# EasyEDA Pro project CW-LINK_PCB.epro

# Board CW-LINK
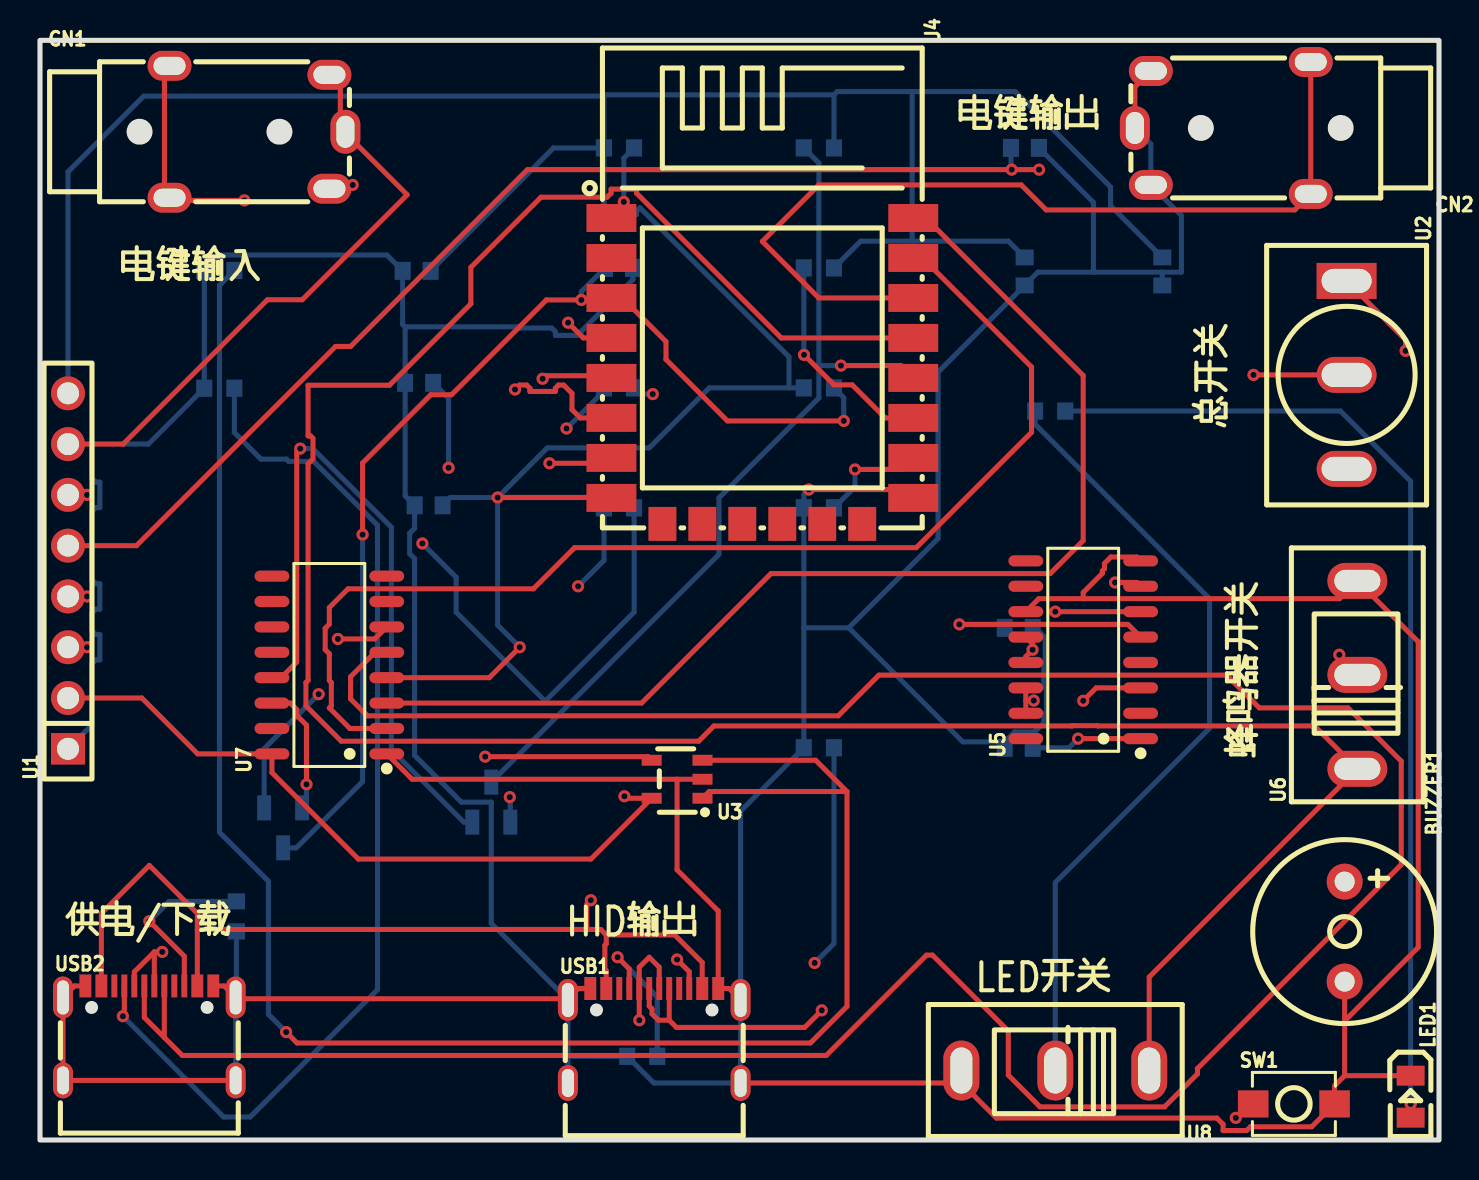
[diagram p0: board, top side]
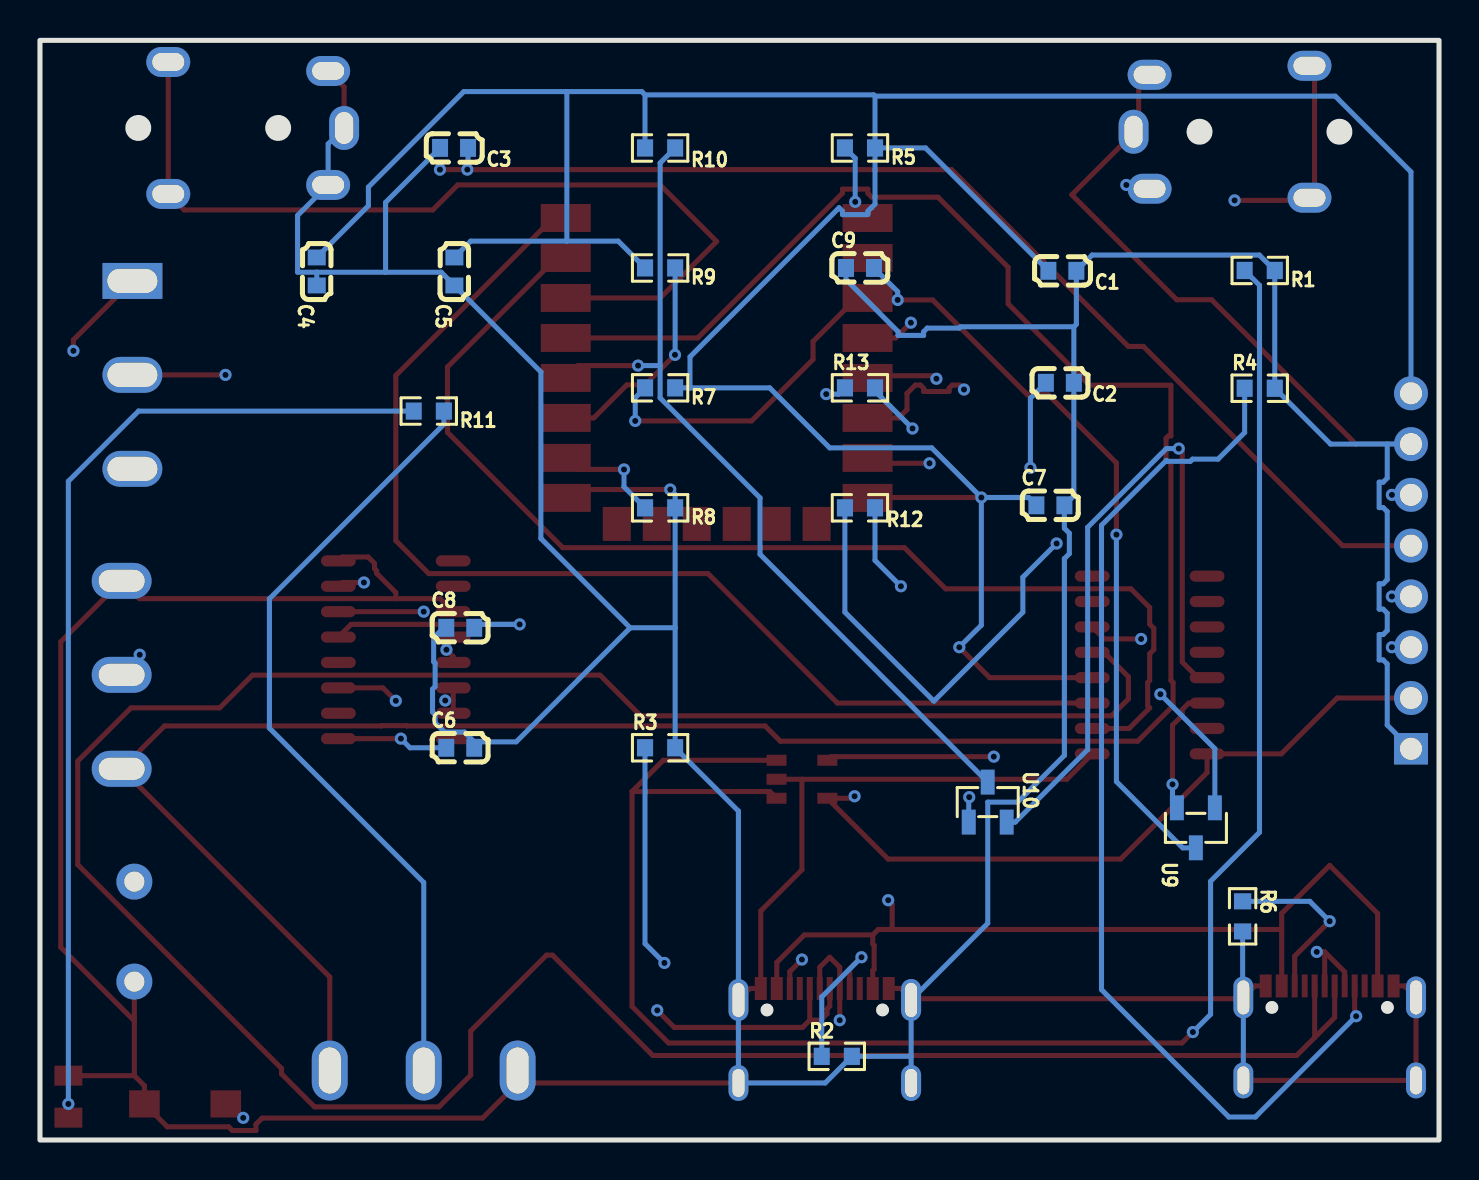
[diagram p1: board, bottom side, seen from below]

Outline 70 x 55 mm; copper layers: Top Layer, Inner1, Inner2, Bottom Layer. Coordinates in mm from the lower left corner of the outline.
Outline path: rectangle 0,55 70,0
Stack: Top Layer 0.035mm 外层铜厚1oz / Dielectric1 0.2104mm 7628 RC49% 8.6mil / Inner1 0.0152mm 内层铜厚 / Dielectric2 1.065mm 1.1mm H/HOZ 含铜 / Inner2 0.0152mm 内层铜厚 / Dielectric3 0.2104mm 7628 RC49% 8.6mil / Bottom Layer 0.035mm 外层铜厚1oz

## Design rules (mm)
template: 自定义配置
spacing copperThickness1oz (default): track to track 0.102, other pairs 0.152 to 0.3
spacing copperThickness2oz: track to track 0.203, other pairs 0.152 to 0.3
track width copperThickness1oz (default): min 0.127, default 0.254, max 2.54
track width normal: min 0.254, default 0.254, max 0.5
differential pair differentialPair (default): width min 0.127, default 0.254, max 2.54; gap min 0.152, default 0.152
via viaSize (default): diameter min 0.5, default 0.61, max 10; hole min 0.3, default 0.305, max 6.299
net TXD uses normal
net RXD uses normal
net KEY_OUT uses normal
net GPIO0 uses normal
net HID_TX uses normal
net KEY_IN2 uses normal
net LCD_SDA uses normal
net LCD_DC uses normal
net LCD_SCL uses normal
net KEY_IN1 uses normal
net EN uses normal
net RST uses normal
net $3N2016 uses normal
net $3N5513 uses normal
net $3N2666 uses normal
net D+ uses normal
net D- uses normal
net $3N2525 uses normal
net RTS uses normal
net DTR uses normal
net $3N3364 uses normal
net $3N3367 uses normal
net $3N4807 uses normal
net $3N4819 uses normal
net UD+ uses normal
net UD- uses normal
net $3N5016 uses normal
net $3N5218 uses normal
net $3N5212 uses normal
net $3N5338 uses normal
net $3N5795 uses normal
net $3N5844 uses normal

## Placement (name value [footprint] x y rotation side)
BUZZER1  3kHz  [BUZ-TH_BD9.0-P5.00-D0.6-FD]  65.28 10.42 270 top
C1  10uf  [C0603]  18.84 43.47 0 bottom
C2  470pf  [C0603]  18.97 37.87 0 bottom
C3  100nf  [C0603]  49.28 49.62 0 bottom
C4  10uf  [C0603]  56.15 43.44 90 bottom
C5  100nf  [C0603]  49.27 43.44 90 bottom
C6  200pf  [C0603]  48.97 19.62 180 bottom
C7  100nf  [C0603]  19.45 31.74 180 bottom
C8  10nf  [C0603]  48.97 25.62 180 bottom
C9  1uf  [C0603]  28.97 43.62 180 bottom
CN1  PJ-322A-Y  [AUDIO-TH_PJ-322A-Y]  10.88 50.43 0 top
CN2  PJ-322A-Y  [AUDIO-TH_PJ-322A-Y]  59.18 50.62 180 top
LED1  KT-0805W  [LED0805-R-RD]  68.58 2.17 270 top
R1  100K  [R0603]  8.97 43.49 0 bottom
R2  5.1K  [R0603]  30.13 4.19 180 bottom
R3  5.1K  [R0603]  38.97 19.62 180 bottom
R4  5.1K  [R0603]  8.97 37.6 180 bottom
R5  10K  [R0603]  28.97 49.62 0 bottom
R6  5.1K  [R0603]  9.83 11.18 270 bottom
R7  10K  [R0603]  38.97 37.62 0 bottom
R8  10K  [R0603]  38.97 31.62 0 bottom
R9  10K  [R0603]  38.97 43.62 0 bottom
R10  10K  [R0603]  38.97 49.62 0 bottom
R11  2R  [R0603]  50.55 36.46 0 bottom
R12  10K  [R0603]  28.97 31.62 0 bottom
R13  10K  [R0603]  28.97 37.62 180 bottom
SW1  -  [Key_SMD_3x4x2]  62.74 1.81 0 top
U1  PM254-1-08-Z-8.5  [HDR-TH_8P-P2.54-V-F]  1.4 28.46 90 top
U2  MT-0-102-A101-M200-RS  [SW-TH_MT-0-103-A101-M200-RS]  65.38 38.27 270 top
U3  MIC5219-3.3YM5-TR  [SOT-23-5_L3.0-W1.7-P0.95-LS2.8-TL]  31.88 18.04 180 top
U4  2.4GHz  [WIFIM-SMD_ESP-12F-ESP8266MOD]  36.14 38.46 270 top
U5  CH9328  [SOP-16_L10.0-W3.9-P1.27-LS6.0-BL]  52.2 24.52 90 top
U6  SS-12D10-G5  [SW-TH_SS-12D10-G050]  65.91 23.27 90 top
U7  CH340C  [SOP-16_L10.0-W3.9-P1.27-LS6.0-BL]  14.48 23.76 90 top
U8  SS-12D10-G5  [SW-TH_SS-12D10-G050]  50.8 3.48 180 top
U9  SS8050 Y1  [SOT-23-3_L2.9-W1.3-P1.90-LS2.4-BR]  12.17 15.61 90 bottom
U10  SS8050 Y1  [SOT-23-3_L2.9-W1.3-P1.90-LS2.4-BR]  22.58 16.9 270 bottom
USB1  TYPE-C16PIN  [USB-C-SMD_TYPE-C16PIN]  30.73 5.22 0 top
USB2  TYPE-C16PIN  [USB-C-SMD_TYPE-C16PIN]  5.47 5.34 0 top

## Footprints (pads in the part's own frame, mm; a bottom-side part is the same pattern mirrored in y, then rotated)
AUDIO-TH_PJ-322A-Y
  oval 1.5x2.2 hole 0.9x1.6: 1(4.4,0)
  oval 2.2x1.5 hole 1.6x0.9: 2(3.6,2.85) 3(-4.4,3.3) 3(-4.4,-3.3) 4(3.6,-2.85)
BUZ-TH_BD9.0-P5.00-D0.6-FD
  round 1.8 hole 1: 1(-2.5,0) 2(2.5,0)
C0603
  rect 0.8x0.9 smd: 1(-0.7,0) 2(0.7,0)
HDR-TH_8P-P2.54-V-F
  rect 1.575x1.7 hole 1.1: 1(-8.89,0)
  round 1.7 hole 1.1: 2(-6.35,0) 3(-3.81,0) 4(-1.27,0) 5(1.27,0) 6(3.81,0) 7(6.35,0) 8(8.89,0)
Key_SMD_3x4x2
  rect 1.53x1.36 smd: 1(-2.035,0) 2(2.035,0)
LED0805-R-RD
  rect 1x1.399 smd: 1(1.05,0) 2(-1.05,0)
R0603
  rect 0.806x0.864 smd: 1(-0.753,0) 2(0.753,0)
SOP-16_L10.0-W3.9-P1.27-LS6.0-BL
  oval 0.56x1.745 smd: 1(-4.445,-2.873) 2(-3.175,-2.873) 3(-1.905,-2.873) 4(-0.635,-2.873) 5(0.635,-2.873) 6(1.905,-2.873) 7(3.175,-2.873) 8(4.445,-2.873) 9(4.445,2.873) 10(3.175,2.873) 11(1.905,2.873) 12(0.635,2.873) 13(-0.635,2.873) 14(-1.905,2.873) 15(-3.175,2.873) 16(-4.445,2.873)
SOT-23-3_L2.9-W1.3-P1.90-LS2.4-BR
  rect 1.25x0.7 smd: 1(1,-0.95) 2(1,0.95) 3(-1,0)
SOT-23-5_L3.0-W1.7-P0.95-LS2.8-TL
  rect 1x0.55 smd: 1(-1.272,0.95) 2(-1.272,0) 3(-1.272,-0.95) 4(1.272,-0.95) 5(1.272,0.95)
SW-TH_MT-0-103-A101-M200-RS
  rect 1.8x3 hole 1.2x2.5: 1(-4.7,0)
  oval 1.8x3 hole 1.2x2.5: 2(0,0) 3(4.7,0)
SW-TH_SS-12D10-G050
  oval 1.8x3 hole 1.1x2.3: 1(-4.7,0) 2(0,0) 3(4.7,0)
USB-C-SMD_TYPE-C16PIN
  oval 1x2.1 hole 0.6x1.7: 1(-4.32,1.788) 2(4.32,1.788)
  oval 1x1.8 hole 0.6x1.4: 3(-4.32,-2.362) 4(4.32,-2.362)
  rect 0.6x1.15 smd: A1B12(-3.2,2.362) A4B9(-2.4,2.362) B1A12(3.2,2.362) B4A9(2.4,2.362)
  rect 0.3x1.15 smd: A5(-1.25,2.362) A6(-0.25,2.362) A7(0.25,2.362) A8(-1.75,2.362) B5(1.75,2.362) B6(0.75,2.362) B7(-0.75,2.362) B8(1.25,2.362)
WIFIM-SMD_ESP-12F-ESP8266MOD
  rect 1.4x2.5 smd: 1(-7.651,-7.551) 2(-5.651,-7.551) 3(-3.651,-7.551) 4(-1.651,-7.551) 5(0.349,-7.551) 6(2.349,-7.551) 7(4.349,-7.551) 8(6.349,-7.551) 9(6.349,7.548) 10(4.349,7.55) 11(2.349,7.551) 12(0.349,7.551) 13(-1.651,7.55) 14(-3.651,7.551) 15(-5.651,7.551) 16(-7.651,7.551)
  rect 1.7x1.4 smd: 17(7.651,-5) 18(7.649,-3.002) 19(7.649,-1.004) 20(7.649,0.998) 21(7.649,2.997) 22(7.651,4.997)

## Nets
3V3: C1.2 C4.2 C5.2 C7.1 R5.1 R7.1 R9.2 R10.2 U1.2 U1.8 U3.5 U4.8 U7.4 U7.16
5V_USB: U2.2 USB1.A4B9 USB1.B4A9 USB2.A4B9 USB2.B4A9
GND: BUZZER1.2 C1.1 C2.1 C3.2 C4.1 C5.1 C6.2 C7.2 C8.1 C9.1 CN1.1 CN1.2 CN2.1 CN2.2 CN2.4 LED1.2 R1.1 R2.2 R3.2 R4.2 R6.2 R8.1 SW1.2 U1.1 U1.7 U3.2 U4.9 U5.8 U5.11 U6.3 U7.1 U8.3 USB1.1 USB1.2 USB1.3 USB1.4 USB1.A1B12 USB1.B1A12 USB2.1 USB2.2 USB2.3 USB2.4 USB2.A1B12 USB2.B1A12
BEEP: U4.13 U6.1 U8.1
D+: U7.5 USB2.A6 USB2.B6
D-: U7.6 USB2.A7 USB2.B7
DTR: R12.2 U7.13 U10.2
EN: C9.2 R7.2 U4.3 U9.3
GPIO0: R10.1 U4.12 U10.3
HID_TX: R9.1 U4.11 U5.3
KEY_IN1: CN1.4 U4.4
KEY_IN2: CN1.3 R8.2 U4.10
KEY_OUT: CN2.3 U4.14
LCD_DC: U1.6 U4.6
LCD_SCL: U1.3 U4.5
LCD_SDA: U1.4 U4.7
RST: C3.1 R5.2 SW1.1 U1.5 U4.1
RTS: R13.2 U7.14 U9.2
RXD: U4.15 U7.2
TXD: U4.16 U7.3
UD+: U5.6 USB1.A6 USB1.B6
UD-: U5.7 USB1.A7 USB1.B7
$3N2016: C2.2 U3.4
$3N2525: R4.1 USB2.A5
$3N2666: R6.1 USB2.B5
$3N3364: R12.1 U9.1
$3N3367: R13.1 U10.1
$3N4807: C6.1 U5.1
$3N4819: C8.2 U5.5
$3N5016: U5.12 U5.13 U5.14 U5.15
$3N5212: R2.1 USB1.A5
$3N5218: R3.1 USB1.B5
$3N5338: BUZZER1.1 U6.2
$3N5513: R1.2 U2.1 U3.1 U3.3
$3N5795: R11.1 U8.2
$3N5844: LED1.1 R11.2

Pads without a net: U2 3; U4 2 17 18 19 20 21 22; U5 2 4 9 10 16; U7 7 8 9 10 11 12 15; USB1 A8 B8; USB2 A8 B8

## Via types
v1: diameter 0.61, hole 0.305, Top Layer to Bottom Layer, 55 vias

## Routing (per net, layer and track width the routed paths; a pad name or vN(x,y) marks a point on that pad's centre or on a via; arc(x,y) is an arc through that point)
3V3: length 209.9
  Top Layer w0.254: U7.4 22.48,23.12 v1(24,24.65) ; U1.2 5.1,22.11 7.89,19.31 U7.16 11.61,18.38 15.93,14.05 27.56,14.05 U3.5 29.34,17.09 v1(29.24,17.19) ; v1(22.9,32.14) 28.57,32.14 U4.8
  Inner1 w0.254: v1(24,24.65) 29.24,19.41 v1(29.24,17.19)
  Bottom Layer w0.254: C1.2 25.69,49.62 R5.1 ; v1(22.9,32.14) 20.54,32.14 C7.1 ; v1(22.9,32.14) 25.38,34.62 30.49,34.62 33.49,37.62 37.48,37.62 ; v1(22.9,32.14) 22.9,25.75 v1(24,24.65) ; 28.22,52.21 5.19,52.21 1.4,48.42 U1.8 ; 28.22,52.21 R5.1 ; 28.22,52.21 28.28,52.27 39.73,52.27 ; R5.1 28.22,46.81 28.4,46.63 28.4,46.63 28.58,46.46 28.58,46.29 29.85,46.29 29.85,46.46 30.02,46.63 37.48,39.17 37.48,37.62 ; 39.73,52.27 39.89,52.44 43.64,52.44 ; 39.73,52.27 R10.2 ; 37.48,37.62 R7.1 ; 43.64,52.44 48.79,52.44 53.57,47.66 53.57,46.73 C4.2 ; 43.64,52.44 43.64,44.96 ; R9.2 41.06,44.96 43.64,44.96 ; 43.64,44.96 48.45,44.96 C5.2
5V_USB: length 100.5
  Top Layer w0.254: 28.33,10.26 28.06,10.53 27.36,10.53 ; 28.33,10.26 28.33,9.81 28.26,9.74 28.26,8.54 28.33,8.47 USB1.A4B9 ; 28.33,10.26 31.76,10.26 33.13,8.88 USB1.B4A9 ; USB2.A4B9 3.07,11.33 5.47,13.73 7.87,11.33 7.87,10.53 ; 27.36,10.53 7.87,10.53 ; 27.36,10.53 27.36,11.79 v1(27.56,11.99) ; 7.87,10.53 USB2.B4A9 ; v1(60.72,38.27) U2.2
  Inner2 w0.254: v1(27.56,11.99) 45,11.99 60.72,27.71 v1(60.72,38.27)
GND: length 402.8
  Top Layer w0.254: 31.88,18.04 18.62,18.04 U7.1 ; 31.88,18.04 31.88,13.51 33.93,11.46 USB1.B1A12 34.48,7.58 USB1.2 ; 31.88,18.04 U3.2 ; 65.28,3.22 64.77,2.71 SW1.2 63.63,0.66 60.56,0.66 60.37,0.47 59.2,0.47 59.2,0.79 58.88,1.1 47.86,1.1 46.1,2.85 ; 65.28,3.22 65.28,5.96 ; 65.28,3.22 LED1.2 ; 46.1,2.85 U8.3 ; 46.1,2.85 USB1.4 ; 65.28,5.96 BUZZER1.2 ; 65.28,5.96 68.96,9.64 68.96,24.92 U6.3 65.02,27.08 52.2,27.08 ; USB2.4 USB2.3 USB2.1 1.73,7.71 USB2.A1B12 ; USB1.A1B12 26.92,7.58 26.41,7.07 ; 26.41,7.07 USB1.1 ; 26.41,7.07 9.85,7.07 USB2.2 9.22,7.71 USB2.B1A12 ; 52.2,27.08 49.97,27.08 U5.11 ; 52.2,27.08 52.2,27.38 53.16,28.34 53.16,28.47 53.26,28.57 53.26,28.84 53.58,29.16 54.88,29.16 U5.8 ; CN2.1 54.78,52.67 CN2.4 ; U4.9 43.27,32.53 v1(38.47,32.53) ; U1.7 4.16,34.81 11.38,42.03 13.12,42.03 18.37,47.27 15.03,50.62 15.03,52.67 14.23,53.47
  Bottom Layer w0.254: 40.47,25.62 38.22,25.62 ; 40.47,25.62 46.17,19.91 48.27,19.91 ; 40.47,25.62 44.94,30.09 44.94,38.41 C5.1 49.93,43.4 52.71,43.4 ; 38.22,25.62 R8.1 38.22,32.29 v1(38.47,32.53) ; 38.22,25.62 R3.2 35.05,16.45 USB1.2 USB1.4 30.71,2.85 R2.2 26.41,4.19 ; 2.59,34.81 5.42,34.81 R4.2 R1.1 8.99,44.26 17.36,44.26 C1.1 18.14,40.8 18.27,40.67 ; 2.59,34.81 2.59,33.1 2.79,32.9 2.99,32.9 2.99,31.63 2.79,31.63 2.59,31.43 2.59,28.02 2.79,27.82 2.99,27.82 2.99,26.55 2.79,26.55 2.59,26.35 2.59,25.48 2.79,25.28 2.99,25.28 2.99,24.01 2.79,24.01 2.59,23.81 2.59,20.76 U1.1 ; 2.59,34.81 U1.7 ; 26.41,4.19 USB1.1 22.58,10.84 22.58,16.9 21.08,16.9 18.74,19.24 18.74,29.08 18.5,29.32 18.5,30.35 18.74,30.6 18.74,31.74 18.27,32.22 C2.1 18.27,40.67 ; 26.41,4.19 USB1.3 ; 52.71,43.4 52.71,46.89 C3.2 ; 52.71,43.4 56.15,43.4 ; C6.2 48.27,19.91 ; 48.27,19.91 48.77,20.41 49.76,20.41 50.23,20.88 50.23,21.28 50.36,21.41 50.36,22.55 50.23,22.68 50.23,23.85 50.3,23.92 50.3,25.12 49.8,25.62 C8.1 ; 18.27,40.67 23.94,40.67 24,40.61 25.61,40.61 25.79,40.43 25.79,40.24 27.06,40.24 27.06,40.43 29.67,43.04 C9.1 ; 56.15,43.4 C4.1 ; 56.15,43.4 57.11,43.4 57.11,46.24 CN2.2 55.58,49.82 CN2.1 ; USB2.4 USB2.2 9.83,7.16 R6.2
BEEP: length 129
  Top Layer w0.254: U8.1 55.5,8.15 U6.1 63.77,20.71 52.92,20.71 52.91,20.72 51.65,20.72 51.64,20.71 33.72,20.71 32.96,19.95 15.07,19.95 13.31,21.72 13.31,22.88 13.41,22.99 13.41,33.82 13.66,34.07 13.66,35.09 13.54,35.22 13.41,35.22 13.41,37.75 17.49,37.75 21.56,41.82 21.56,43.65 25.07,47.16 28.37,47.16 28.58,47.36 28.58,47.56 29.85,47.56 29.85,47.36 37.09,40.12 U4.13
D+: length 143.7
  Top Layer w0.254: 6.22,5.13 5.22,6.13 USB2.A6 ; 6.22,5.13 USB2.B6 ; 6.22,5.13 7.12,4.23 39.34,4.23 44.35,9.25 44.66,9.25 48.45,5.45 48.45,3.24 50.04,1.66 56.26,1.66 57.91,3.31 57.91,3.58 68.11,13.77 68.11,18.95 65.45,21.61 61.01,21.61 59.37,23.25 41.97,23.25 39.94,21.22 16.38,21.22 15.54,22.06 15.54,23.17 16.76,24.39 U7.5
D-: length 28.5
  Top Layer w0.254: U7.6 16.75,25.06 v1(14.91,25.06) ; 5.72,9.41 4.72,8.41 USB2.B7 ; 5.72,9.41 USB2.A7 ; 5.72,9.41 v1(6.12,9.41)
  Inner1 w0.254: v1(6.12,9.41) 6.12,20.12 9.61,23.61 12.37,23.61 13.82,25.06 v1(14.91,25.06)
DTR: length 65.2
  Top Layer w0.254: U7.13 12.06,23.12 12.85,23.9 12.85,34.4 v1(13.02,34.58)
  Inner2 w0.254: v1(19.13,29.84) 14.39,34.58 v1(13.02,34.58)
  Bottom Layer w0.254: v1(13.02,34.58) 13.65,34.58 17.58,30.65 17.58,19.52 21.2,15.9 U10.2 ; R12.2 29.73,26.4 25.27,21.95 20.82,26.4 20.82,28.15 v1(19.13,29.84)
EN: length 55.8
  Top Layer w0.254: v1(40.22,35.97) 34.4,35.97 31.32,39.04 31.32,39.93 29.14,42.12 U4.3 28.49,42.02 v1(27.09,42.02) 25.34,42.02 20.59,37.27 19.55,37.27 16.14,33.86 v1(16.14,30.28)
  Bottom Layer w0.254: R7.2 40.22,37.13 v1(40.22,35.97) ; U9.3 12.83,14.61 16.14,17.93 v1(16.14,30.28) ; C9.2 27.09,42.43 v1(27.09,42.02)
GPIO0: length 43.8
  Top Layer w0.254: U4.12 43.08,38.73 v1(40.07,38.73)
  Bottom Layer w0.254: R10.1 38.97,48.86 38.97,38.73 ; U10.3 33.97,29.29 33.97,32.12 38.97,37.12 38.97,38.73 ; v1(40.07,38.73) 38.97,38.73
HID_TX: length 37.9
  Top Layer w0.254: v1(52.2,21.97) 52.84,22.61 U5.3 ; U4.11 42.29,36.12 40.64,37.77 39.73,37.77 v1(38.23,39.27)
  Inner1 w0.254: v1(38.23,39.27) 39.51,37.99 40.39,37.99 52.2,26.18 v1(52.2,21.97)
  Bottom Layer w0.254: R9.1 38.22,39.28 v1(38.23,39.27)
KEY_IN1: length 17.5
  Top Layer w0.254: U4.4 27.19,40.12 v1(26.42,40.88) ; v1(15.65,47.77) 14.23,47.77
  Inner1 w0.254: v1(26.42,40.88) 22.54,40.88 v1(15.65,47.77)
KEY_IN2: length 54.7
  Top Layer w0.254: 6.23,53.92 6.23,47.32 6.55,47 v1(10.23,47) ; U4.10 43.12,33.54 v1(40.78,33.54)
  Inner2 w0.254: v1(40.78,33.54) 34.3,33.54 31.85,35.99 27.1,35.99 26.86,36.22 25.82,36.22 25.59,35.99 25.38,36.2 25.38,37.24 25.58,37.44 25.78,37.44 25.78,38.71 25.58,38.71 22.64,41.66 15.57,41.66 v1(10.23,47)
  Bottom Layer w0.254: v1(40.78,33.54) 40.78,32.67 R8.2
KEY_OUT: length 44.8
  Top Layer w0.254: U4.14 38.97,42.12 36.14,44.94 38.97,47.77 49.1,47.77 50.35,46.52 62.78,46.52 CN2.3 CN2.3
LCD_DC: length 32.5
  Top Layer w0.254: v1(23.77,37.54) 23.99,37.76 24.35,37.76 24.51,37.6 24.51,37.44 25.78,37.44 25.78,37.6 25.95,37.76 26.2,37.76 26.62,37.34 26.62,36.53 27.03,36.12 U4.6 ; v1(2.36,32.27) U1.6
  Inner2 w0.254: v1(23.77,37.54) 5.27,37.54 2.63,34.9 2.63,32.54 v1(2.36,32.27)
LCD_SCL: length 41.3
  Top Layer w0.254: v1(2.36,24.65) U1.3 ; U4.5 28.48,38.23 25.3,38.23 v1(25.15,38.07)
  Inner1 w0.254: v1(25.15,38.07) 25.15,35.18 13.66,35.18 13.66,35.22 12.39,35.22 12.39,33.94 12.63,33.94 12.63,24.65 v1(2.36,24.65)
LCD_SDA: length 30.1
  Top Layer w0.254: v1(25.49,33.85) 28.32,33.85 U4.7 ; v1(2.36,27.19) U1.4
  Inner2 w0.254: v1(25.49,33.85) 18.83,27.19 v1(2.36,27.19)
RST: length 134.2
  Top Layer w0.254: v1(29.21,46.92) 29.21,46.74 U4.1 ; v1(49.99,48.53) v1(48.62,48.53) 24.39,48.53 15.54,39.69 14.79,39.69 4.83,29.73 U1.5 ; v1(59.83,1.11) 60.53,1.81 SW1.1
  Inner1 w0.254: v1(49.99,48.53) 49.99,43.37 59.83,33.53 v1(59.83,1.11)
  Inner2 w0.254: v1(29.21,46.92) 30.82,48.53 v1(48.62,48.53)
  Bottom Layer w0.254: v1(29.21,46.92) 29.21,49.1 R5.2 ; C3.1 48.58,48.57 v1(48.62,48.53)
RTS: length 36.4
  Top Layer w0.254: v1(13.33,17.79) 13.33,20.75 12.88,21.2 12.87,21.2 12.85,21.22 12.85,21.53 12.52,21.85 U7.14
  Inner1 w0.254: v1(13.33,17.79) 15.33,19.79 15.33,24.32 15.54,24.53 15.54,25.59 15.33,25.8 15.33,30.84 19.15,34.66 25.41,34.66 v1(26.34,35.59)
  Bottom Layer w0.254: v1(13.33,17.79) 13.33,16.83 U9.2 ; R13.2 28.22,37.46 v1(26.34,35.59)
RXD: length 58.8
  Top Layer w0.254: U7.2 15.51,20.58 14.48,21.61 14.58,21.71 14.58,22.88 14.48,22.98 14.48,24.32 14.27,24.53 14.27,25.59 14.48,25.8 14.48,26.63 15.41,27.57 24.69,27.57 26.75,29.62 43.84,29.62 49.61,35.4 49.61,38.66 44.16,44.12 U4.15
TXD: length 58.2
  Top Layer w0.254: U4.16 43.92,45.89 44.54,45.89 52.2,38.24 52.2,29.98 50.55,28.33 36.58,28.33 30.1,21.85 U7.3
UD+: length 41.2
  Top Layer w0.254: v1(50.8,26.42) U5.6 ; 31.48,5.99 31.85,5.63 38.26,5.63 v1(39.12,6.49) ; 31.48,5.99 30.94,5.99 30.62,6.31 30.62,6.56 30.48,6.7 USB1.A6 ; 31.48,5.99 USB1.B6
  Inner1 w0.254: v1(39.12,6.49) 39.12,7.99 39.39,8.27 39.39,9.44 39.35,9.49 39.3,9.49 50.8,20.99 v1(50.8,26.42)
UD-: length 46.4
  Top Layer w0.254: U5.7 54.88,27.88 v1(53.79,27.88) ; v1(29.99,5.99) 29.98,5.99 USB1.B7 29.98,8.64 30.48,9.14 30.98,8.64 USB1.A7
  Inner1 w0.254: v1(53.79,27.88) 53.79,20.79 52.34,19.34 49.7,19.34 42.45,12.1 42.45,8.76 38.55,4.85 31.12,4.85 v1(29.99,5.99)
$3N2016: length 28.2
  Top Layer w0.254: v1(22.28,19.17) 30.43,19.17 U3.4
  Inner1 w0.254: v1(22.28,19.17) 20.45,21 v1(20.45,33.62)
  Bottom Layer w0.254: v1(20.45,33.62) 20.45,37.1 C2.2
$3N2525: length 53.6
  Top Layer w0.254: v1(4.15,6.19) 4.22,6.27 USB2.A5
  Bottom Layer w0.254: v1(4.15,6.19) 9.19,1.15 10.52,1.15 16.89,7.52 16.89,30.75 13.65,33.99 13.6,33.94 12.44,33.94 12.33,34.05 11.06,34.05 9.73,35.38 R4.1
$3N2666: length 8.7
  Top Layer w0.254: USB2.B5 7.22,9.19 v1(5.47,10.94)
  Bottom Layer w0.254: R6.1 6.47,11.94 v1(5.47,10.94)
$3N3364: length 27.5
  Inner2 w0.254: v1(26.92,27.69) 26.92,26.04 23.18,22.3 v1(13.94,22.3)
  Bottom Layer w0.254: v1(26.92,27.69) 28.22,28.99 R12.1 ; U9.1 11.21,19.57 v1(13.94,22.3)
$3N3367: length 28.4
  Inner1 w0.254: 30.66,30.04 v1(30.66,37.31) ; v1(23.51,17.15) 23.51,20.93 21.48,22.95 21.48,23.28 23.66,25.46 25.95,25.46 30.53,30.04
  Bottom Layer w0.254: U10.1 23.53,17.13 v1(23.51,17.15) ; R13.1 30.04,37.31 v1(30.66,37.31)
$3N4807: length 5.6
  Top Layer w0.254: v1(51.94,20.07) U5.1
  Bottom Layer w0.254: C6.1 51.49,19.62 v1(51.94,20.07)
$3N4819: length 11.7
  Top Layer w0.254: v1(46,25.79) 54.43,25.79 U5.5
  Bottom Layer w0.254: v1(46,25.79) 48.1,25.79 C8.2
$3N5016: length 5.8
  Top Layer w0.254: 49.32,21.98 v1(49.72,21.98) ; 49.32,21.98 U5.14 ; 49.32,21.98 U5.15 ; U5.12 49.66,24.81 v1(49.66,24.52) 49.32,24.18 U5.13
  Inner1 w0.254: v1(49.66,24.52) 49.72,24.46 v1(49.72,21.98)
$3N5212: length 7.6
  Top Layer w0.254: USB1.A5 29.48,8.56 v1(28.9,9.14)
  Bottom Layer w0.254: R2.1 30.89,7.16 v1(28.9,9.14)
$3N5218: length 19.8
  Top Layer w0.254: v1(31.88,9.03) 32.48,8.42 USB1.B5
  Inner2 w0.254: v1(31.88,9.03) 32.05,8.86 v1(38.76,8.86)
  Bottom Layer w0.254: v1(38.76,8.86) 39.73,9.82 R3.1
$3N5338: length 13.6
  Top Layer w0.254: U6.2 65.01,24.17 v1(65.01,24.27)
  Inner1 w0.254: BUZZER1.1 64.1,14.1 64.1,23.36 v1(65.01,24.27)
$3N5513: length 184.6
  Top Layer w0.254: 40.38,17.43 40.38,6.68 38.55,4.85 12.86,4.85 v1(12.32,5.4) ; 40.38,17.43 38.81,18.99 U3.3 ; 40.38,17.43 33.48,17.43 U3.1 ; U2.1 68.33,40.02 v1(68.33,39.47)
  Inner2 w0.254: v1(12.32,5.4) 17.94,11.02 65.35,11.02 68.33,13.99 v1(68.33,39.47)
  Bottom Layer w0.254: R1.2 8.98,42.75 8.98,15.39 11.43,12.94 11.43,6.29 v1(12.32,5.4)
$3N5795: length 39.8
  Bottom Layer w0.254: R11.1 49.79,35.8 58.52,27.07 58.52,20.6 50.8,12.88 U8.2
$3N5844: length 50.6
  Top Layer w0.254: LED1.1 v1(68.58,1.8)
  Bottom Layer w0.254: v1(68.58,1.8) 68.58,32.94 65.07,36.46 R11.2

## Text on the board
Top Silkscreen Layer: 供电/下载 | 电键输入 | HID输出 | 电键输出 | 总开关 | LED开关 | 蜂鸣器开关
